# EAGLE design Main (EAGLE 7.2.0)
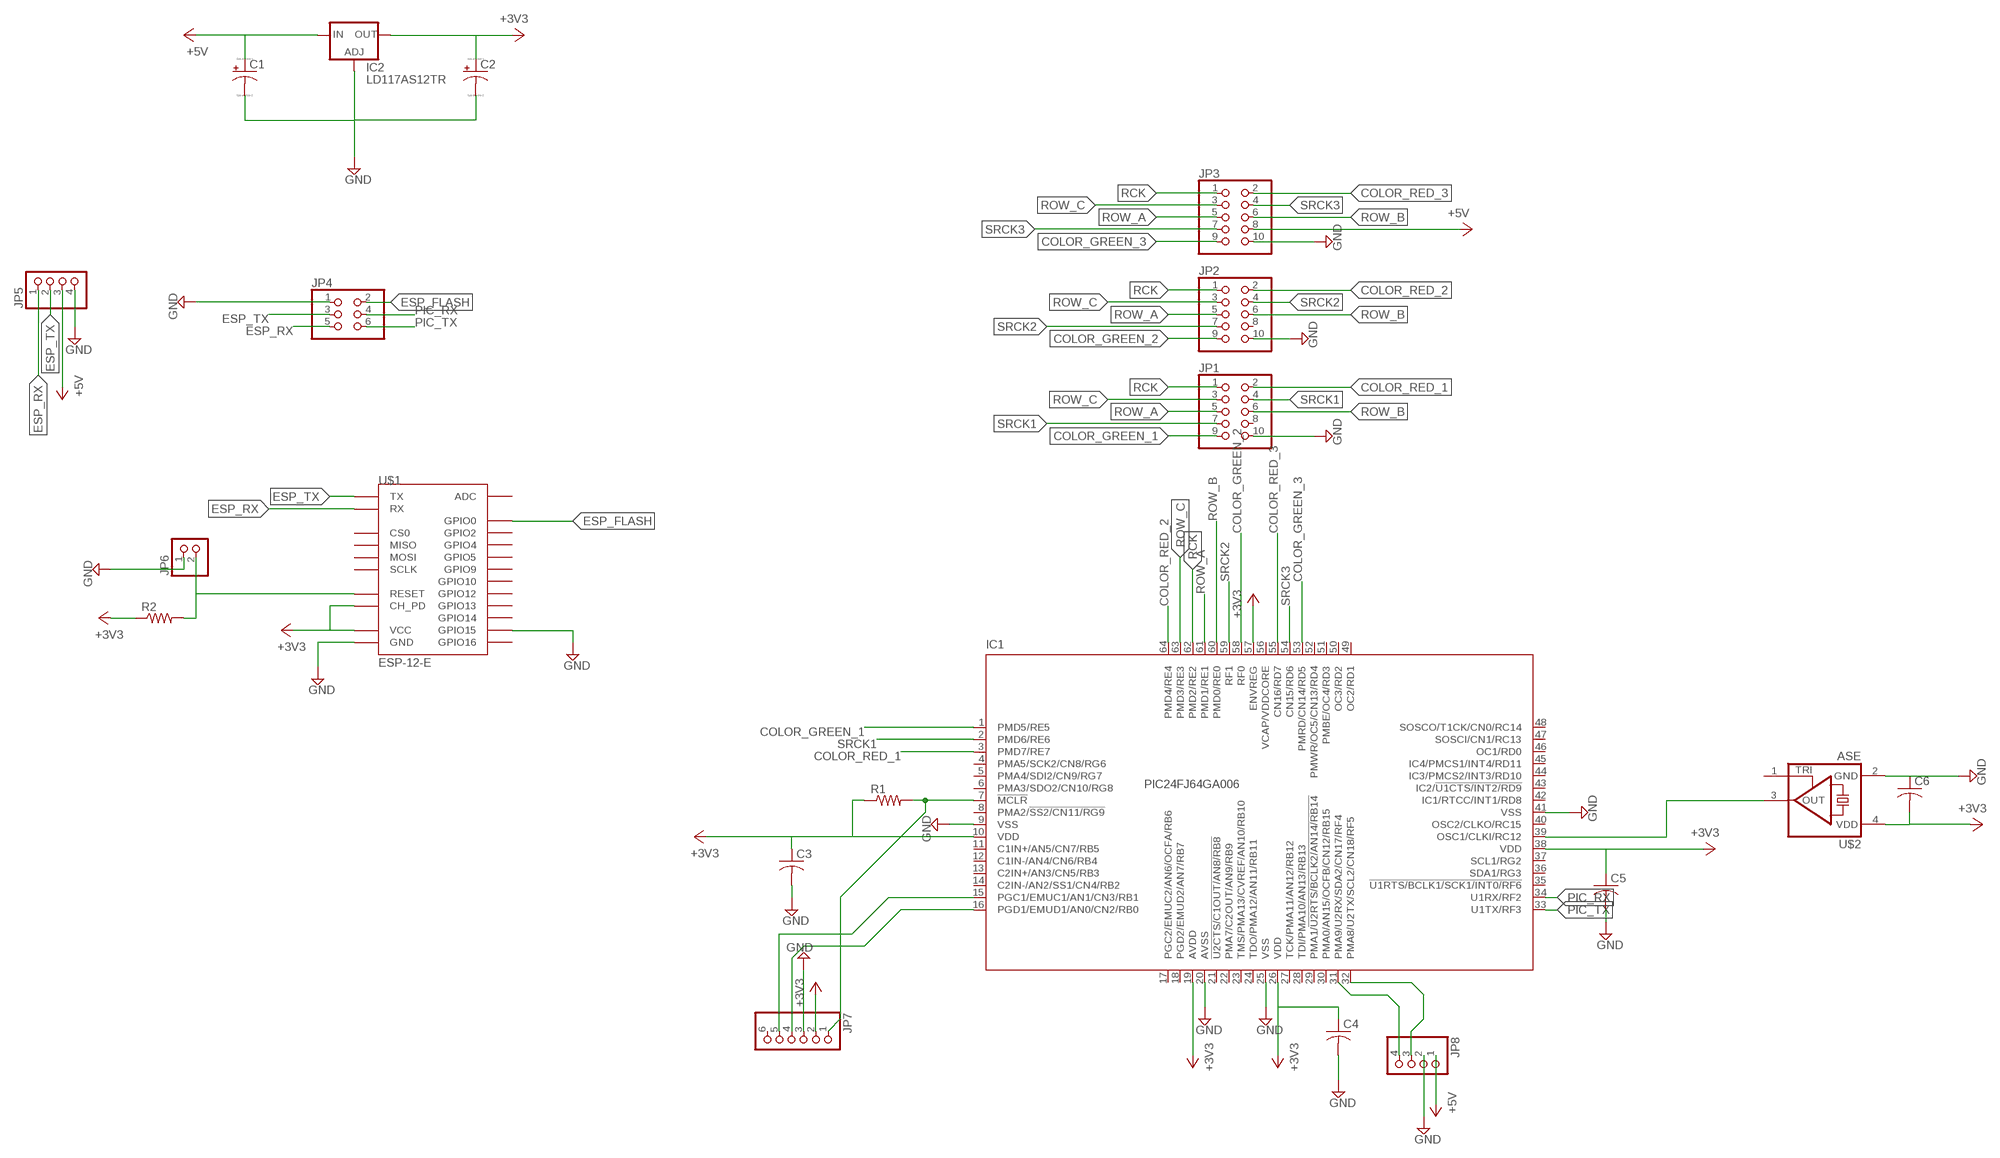
[diagram p0: schematic, sheet 1]

## Parts
C1  CPOL-USB/3528-21W  [B/3528-21W]
C2  CPOL-USB/3528-21W  [B/3528-21W]
C3  C-USC0603K  [C0603K]
C4  C-USC0603K  [C0603K]
C5  C-USC0603K  [C0603K]
C6  C-USC0603K  [C0603K]
IC1  PIC24FJ64GA006  [TQFP64-10X10]
IC2  LD117AS12TR  [SOT223]
JP1  PINHD-2X5  [2X05]
JP2  PINHD-2X5  [2X05]
JP3  PINHD-2X5  [2X05]
JP4  PINHD-2X3  [2X03]
JP5  PINHD-1X4  [1X04]
JP6  PINHD-1X2  [1X02]
JP7  PINHD-1X6  [1X06]
JP8  PINHD-1X4  [1X04]
R1  R-US_MELF0102W  [MINI_MELF-0102W]
R2  R-US_MELF0102W  [MINI_MELF-0102W]
U$1  ESP-12-E  [ESP-12-E]
U$2  ASE  [ASE]

## Nets
+3V3: C2.+ C3.1 C4.1 C5.1 C6.2 IC1.10(VDD) IC1.19(AVDD) IC1.26(VDD) IC1.38(VDD) IC1.57(ENVREG) IC2.4(OUT) JP7.2 R1.1 R2.1 U$1.CH_PD U$1.VCC U$2.4(VDD)
+5V: C1.+ IC2.3(IN) JP3.8 JP5.3 JP8.1
COLOR_GREEN_1: IC1.1(PMD5/RE5) JP1.9
COLOR_GREEN_2: IC1.58(RF0) JP2.9
COLOR_GREEN_3: IC1.53(PMRD/CN14/RD5) JP3.9
COLOR_RED_1: IC1.3(PMD7/RE7) JP1.2
COLOR_RED_2: IC1.64(PMD4/RE4) JP2.2
COLOR_RED_3: IC1.55(CN16/RD7) JP3.2
ESP_FLASH: JP4.2 U$1.GPIO0
ESP_RX: JP4.5 JP5.1 U$1.RX
ESP_TX: JP4.3 JP5.2 U$1.TX
GND: C1.- C2.- C3.2 C4.2 C5.2 C6.1 IC1.9(VSS) IC1.20(AVSS) IC1.25(VSS) IC1.41(VSS) IC2.1(ADJ) JP1.10 JP2.10 JP3.10 JP4.1 JP5.4 JP6.1 JP7.3 JP8.2 U$1.GND U$1.GPIO15 U$2.2(GND)
N$1: IC1.39(OSC1/CLKI/RC12) U$2.3(OUT)
N$2: JP6.2 R2.2 U$1.RESET
N$3: IC1.15(PGC1/EMUC1/AN1/CN3/RB1) JP7.5
N$4: IC1.32(PMA8/U2TX/SCL2/CN18/RF5) JP8.3
N$5: IC1.16(PGD1/EMUD1/AN0/CN2/RB0) JP7.4
N$6: IC1.31(PMA9/U2RX/SDA2/CN17/RF4) JP8.4
N$7: IC1.7(!MCLR) JP7.1 R1.2
PIC_RX: IC1.34(U1RX/RF2) JP4.4
PIC_TX: IC1.33(U1TX/RF3) JP4.6
RCK: IC1.62(PMD2/RE2) JP1.1 JP2.1 JP3.1
ROW_A: IC1.61(PMD1/RE1) JP1.5 JP2.5 JP3.5
ROW_B: IC1.60(PMD0/RE0) JP1.6 JP2.6 JP3.6
ROW_C: IC1.63(PMD3/RE3) JP1.3 JP2.3 JP3.3
SRCK1: IC1.2(PMD6/RE6) JP1.4 JP1.7
SRCK2: IC1.59(RF1) JP2.4 JP2.7
SRCK3: IC1.54(CN15/RD6) JP3.4 JP3.7
Unconnected: IC1.4(PMA5/SCK2/CN8/RG6) IC1.5(PMA4/SDI2/CN9/RG7) IC1.6(PMA3/SDO2/CN10/RG8) IC1.8(PMA2/!SS2/CN11/RG9) IC1.11(C1IN+/AN5/CN7/RB5) IC1.12(C1IN-/AN4/CN6/RB4) IC1.13(C2IN+/AN3/CN5/RB3) IC1.14(C2IN-/AN2/SS1/CN4/RB2) IC1.17(PGC2/EMUC2/AN6/OCFA/RB6) IC1.18(PGD2/EMUD2/AN7/RB7) IC1.21(!U2CTS/C1OUT/AN8/RB8) IC1.22(PMA7/C2OUT/AN9/RB9) IC1.23(TMS/PMA13/CVREF/AN10/RB10) IC1.24(TDO/PMA12/AN11/RB11) IC1.27(TCK/PMA11/AN12/RB12) IC1.28(TDI/PMA10/AN13/RB13) IC1.29(PMA1/!U2RTS/BCLK2/AN14/RB14) IC1.30(PMA0/AN15/OCFB/CN12/RB15) IC1.35(!U1RTS/BCLK1/SCK1/INT0/RF6) IC1.36(SDA1/RG3) IC1.37(SCL1/RG2) IC1.40(OSC2/CLKO/RC15) IC1.42(IC1/RTCC/INT1/RD8) IC1.43(IC2/!U1CTS/INT2/RD9) IC1.44(IC3/PMCS2/INT3/RD10) IC1.45(IC4/PMCS1/INT4/RD11) IC1.46(OC1/RD0) IC1.47(SOSCI/CN1/RC13) IC1.48(SOSCO/T1CK/CN0/RC14) IC1.49(OC2/RD1) IC1.50(OC3/RD2) IC1.51(PMBE/OC4/RD3) IC1.52(PMWR/OC5/CN13/RD4) IC1.56(VCAP/VDDCORE) JP1.8 JP2.8 JP7.6 U$1.ADC U$1.CS0 U$1.GPIO2 U$1.GPIO4 U$1.GPIO5 U$1.GPIO9 U$1.GPIO10 U$1.GPIO12 U$1.GPIO13 U$1.GPIO14 U$1.GPIO16 U$1.MISO U$1.MOSI U$1.SCLK U$2.1(TRI)

## Library data of the parts
C1 C2 = resistor:CPOL-US: POLARIZED CAPACITOR, American symbol
C3-C6 = resistor:C-US: CAPACITOR, American symbol
IC1 = microchip:PIC24FJ*GA006: 64/80/100-Pin General Purpose, 16-Bit Flash Microcontrollers Source: http://ww1.microchip.com/downloads/en/DeviceDoc/39747d.pdf; MPN: PIC24FJ64GA006-I/PT; OC_FARNELL: 1146524; OC_NEWARK: 56K7343
IC2 = v-reg:LD117A?*: Low drop fixed and adjustable positive voltage regulators 1 A Source: http://www.st.com/stonline/products/literature/ds/7194/ld1117axx.pdf
JP1-JP3 = pinhead:PINHD-2X5: PIN HEADER
JP4 = pinhead:PINHD-2X3: PIN HEADER
JP5 JP8 = pinhead:PINHD-1X4: PIN HEADER
JP6 = pinhead:PINHD-1X2: PIN HEADER
JP7 = pinhead:PINHD-1X6: PIN HEADER
R1 R2 = resistor:R-US_: RESISTOR, American symbol
U$1 = esp8266modules:ESP-12-E: ESP8266 Wifi Module ESP-12-E; DIMENSIONS: 24.0 x 16.0 mm; PINS: 22; PITCH: 0.078" / 2 mm
U$2 = crystal:ASE: 3.3Vdc CMOS SMD CRYSTAL CLOCK OSCILLATOR SOurce: www.abracon.com; OC_FARNELL: unknown; OC_NEWARK: unknown

## Board
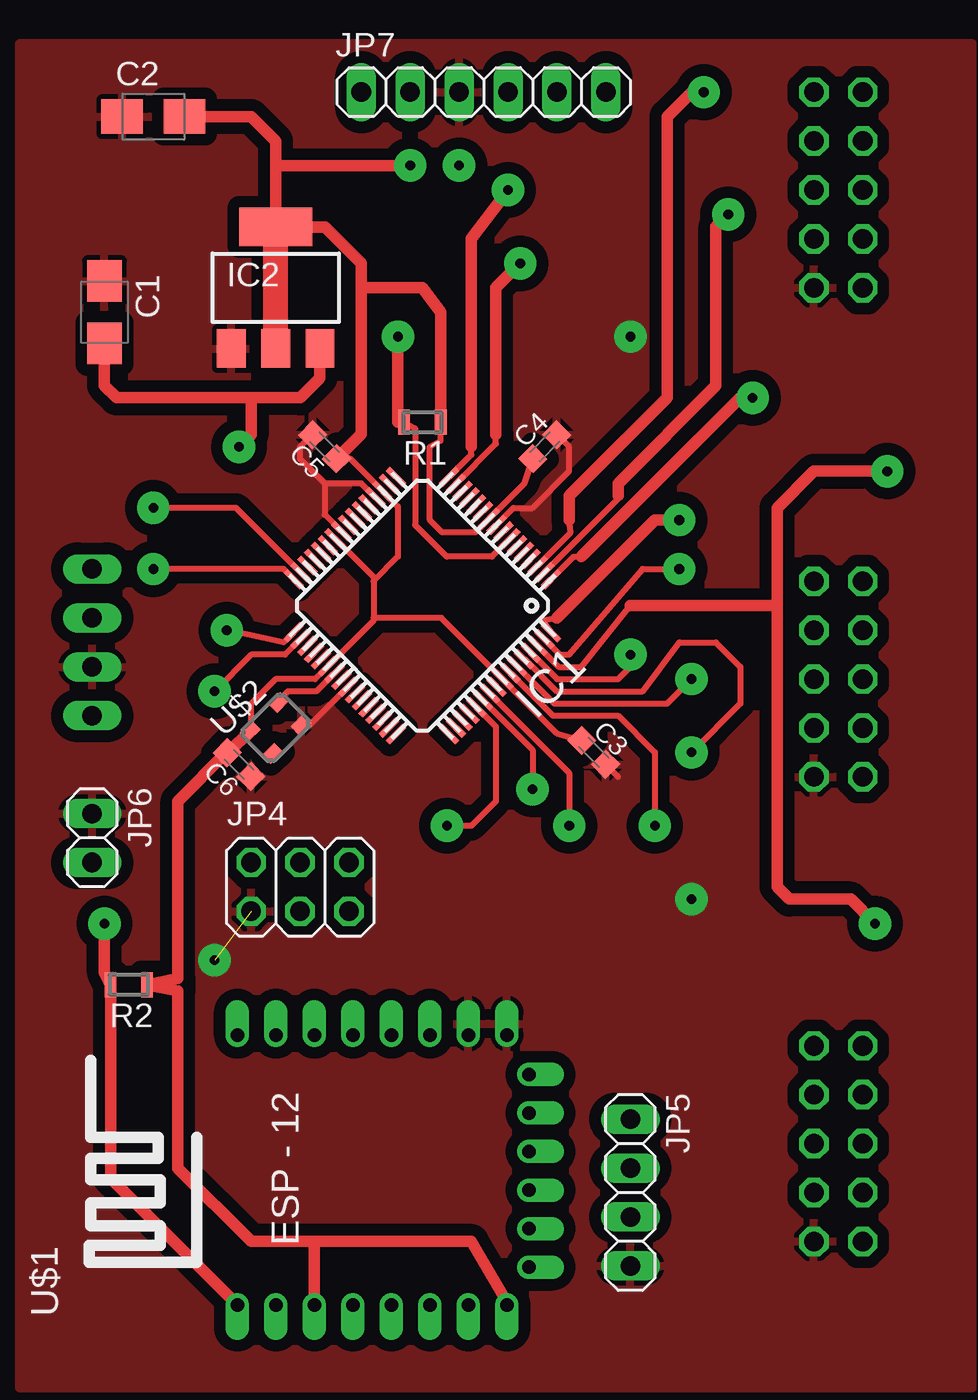
[diagram p1: board, top side]
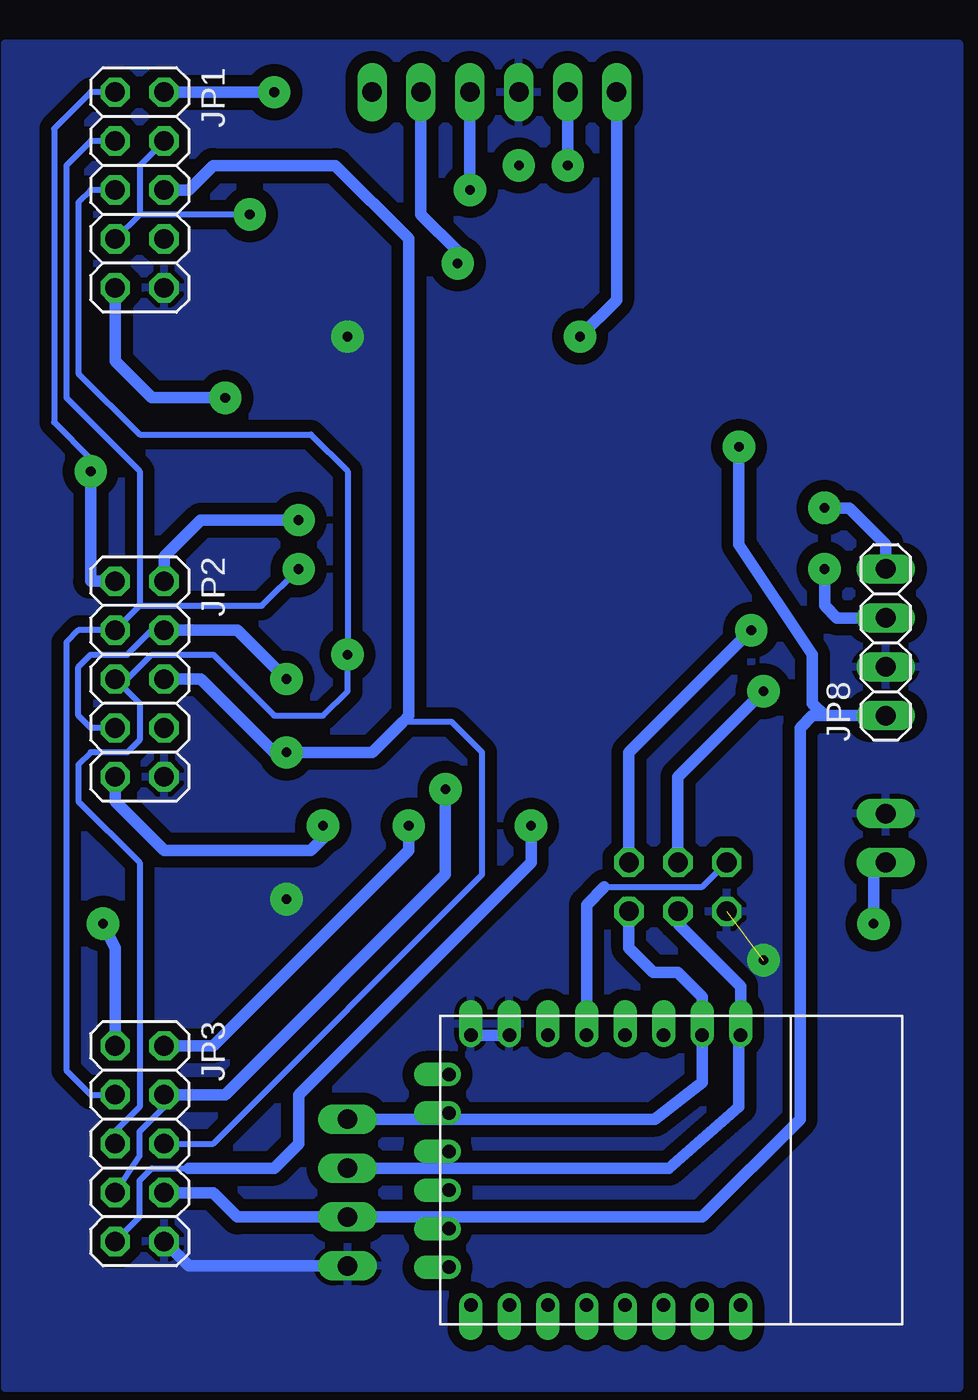
[diagram p2: board, bottom side, seen from below]

No outline drawn. Coordinates in mm, seen from the top.
Copper layers (1*16): Top 0.035mm / dielectric 1.5mm / Bottom 0.035mm
Design rules "default": minimum track width 10mil, minimum drill 24mil, track to track 8mil, track to pad 8mil, pad to pad 8mil, via to via 8mil, smd to smd 8mil, copper to edge 40mil, drill to drill 8mil, minimum pad ring 10mil, minimum via ring 8mil, stop-mask expansion 4mil, vias tented up to drill 0mil, thermal gap 10mil

### Footprints (pad centres in the part's own frame; a part is rotated, then mirrored left to right if it is on the bottom)
B/3528-21W = smd 2.15 x 1.8: + 1.625,0; - -1.625,0
C0603K = smd 1.05 x 1.08: 1 -0.875,0; 2 0.875,0
TQFP64-10X10 = smd 1.2 x 0.3: 1 -5.7,3.75; 2 -5.7,3.25; 3 -5.7,2.75; 4 -5.7,2.25; 5 -5.7,1.75; 6 -5.7,1.25; 7 -5.7,0.75; 8 -5.7,0.25; 9 -5.7,-0.25; 10 -5.7,-0.75; 11 -5.7,-1.25; 12 -5.7,-1.75; 13 -5.7,-2.25; 14 -5.7,-2.75; 15 -5.7,-3.25; 16 -5.7,-3.75; 33 5.7,-3.75; 34 5.7,-3.25; 35 5.7,-2.75; 36 5.7,-2.25; 37 5.7,-1.75; 38 5.7,-1.25; 39 5.7,-0.75; 40 5.7,-0.25; 41 5.7,0.25; 42 5.7,0.75; 43 5.7,1.25; 44 5.7,1.75; 45 5.7,2.25; 46 5.7,2.75; 47 5.7,3.25; 48 5.7,3.75 | smd 0.3 x 1.2: 17 -3.75,-5.7; 18 -3.25,-5.7; 19 -2.75,-5.7; 20 -2.25,-5.7; 21 -1.75,-5.7; 22 -1.25,-5.7; 23 -0.75,-5.7; 24 -0.25,-5.7; 25 0.25,-5.7; 26 0.75,-5.7; 27 1.25,-5.7; 28 1.75,-5.7; 29 2.25,-5.7; 30 2.75,-5.7; 31 3.25,-5.7; 32 3.75,-5.7; 49 3.75,5.7; 50 3.25,5.7; 51 2.75,5.7; 52 2.25,5.7; 53 1.75,5.7; 54 1.25,5.7; 55 0.75,5.7; 56 0.25,5.7; 57 -0.25,5.7; 58 -0.75,5.7; 59 -1.25,5.7; 60 -1.75,5.7; 61 -2.25,5.7; 62 -2.75,5.7; 63 -3.25,5.7; 64 -3.75,5.7
SOT223 = smd 1.5 x 2: 1 -2.3,-3.15; 2 0,-3.15; 3 2.3,-3.15 | smd 3.8 x 2: 4 0,3.15
2X05 = drill 1.016 octagon: 1 -5.08,-1.27; 2 -5.08,1.27; 3 -2.54,-1.27; 4 -2.54,1.27; 5 0,-1.27; 6 0,1.27; 7 2.54,-1.27; 8 2.54,1.27; 9 5.08,-1.27; 10 5.08,1.27
2X03 = drill 1.016 octagon: 1 -2.54,-1.27; 2 -2.54,1.27; 3 0,-1.27; 4 0,1.27; 5 2.54,-1.27; 6 2.54,1.27
1X04 = drill 1.016 long: 1 -3.81,0; 2 -1.27,0; 3 1.27,0; 4 3.81,0
1X02 = drill 1.016 long: 1 -1.27,0; 2 1.27,0
1X06 = drill 1.016 long: 1 -6.35,0; 2 -3.81,0; 3 -1.27,0; 4 1.27,0; 5 3.81,0; 6 6.35,0
MINI_MELF-0102W = smd 0.6 x 1.3: 1 -0.95,0; 2 0.95,0
ESP-12-E = drill 0.7 offset: ADC -7.1,3.8; CH_PD -7.1,1.8; CS0 -5.14,-9.33; GND 6.9,-8.2; GPIO0 6.9,-2.2; GPIO2 6.9,-4.2; GPIO4 6.9,1.8; GPIO5 6.9,-0.2; GPIO9 -1.14,-9.33; GPIO10 0.86,-9.33; GPIO12 -7.1,-4.2; GPIO13 -7.1,-6.2; GPIO14 -7.1,-2.2; GPIO15 6.9,-6.2; GPIO16 -7.1,-0.2; MISO -3.14,-9.33; MOSI 2.86,-9.33; RESET -7.1,5.8; RX 6.9,3.8; SCLK 4.86,-9.33; TX 6.9,5.8; VCC -7.1,-8.2
ASE = smd 0.9 x 0.65: 1 -1.05,-0.825; 2 1.05,-0.825; 3 1.05,0.825; 4 -1.05,0.825

### Placement (x,y rotation side)
C1  52.07,69.85 270 top
C2  54.61,80.01 0 top
C3  77.47,46.99 315 top
C4  74.93,62.87 45 top
C5  63.5,62.87 135 top
C6  59.05,46.35 135 top
IC1  68.58,54.61 225 top
IC2  60.96,71.12 0 top
JP1  90.17,76.2 270 bottom
JP2  90.17,50.8 270 bottom
JP3  90.17,26.67 270 bottom
JP4  62.23,40.01 0 top
JP5  79.38,24.13 270 top
JP6  51.44,42.55 270 top
JP7  71.75,81.28 0 top
JP8  51.44,52.7 90 bottom
R1  68.58,64.14 180 top
R2  53.34,34.92 180 top
U$1  64.77,25.4 90 top
U$2  60.96,48.26 45 top

### Tracks (layer width: path | path; a pad name or v marks a point on that pad's centre or on a via)
+3V3  (via drill 0.5 pad 1.68)
  Top 0.305: U$2.4 59.69,48.16 59.69,49.53 60.96,50.8 63,50.8 IC1.38 66.04,53.84 66.04,53.98 | 74.3,62.23 C4.1 73.89,60.98 IC1.10 71.33,58.42 69.6,58.42 68.96,59.05 68.96,62.87 69.53,63.18 R1.1 | IC1.26 66.04,56.09 66.04,55.88 | 66.04,55.88 66.04,53.98 | 66.04,55.88 67.31,57.15 67.31,59.77 IC1.19 64.83,62.25 C5.1 | 66.04,53.98 69.57,53.98 IC1.57 75.56,47.98 C3.1
  Top 0.61: U$1.CH_PD 62.97,21.59 | 62.97,21.59 59.69,21.59 55.88,25.4 55.88,34.6 R2.1 55.88,35.24 55.88,44.45 58.4,46.97 C6.2 58.51,46.97 U$2.4 | U$1.VCC 72.97,18.47 71.12,21.59 62.97,21.59 | 60.96,77.47 60.96,78.74 59.69,80.01 C2.+ | 60.96,77.47 IC2.4 63.52,74.27 65.41,72.39 65.41,71.12 | 60.96,77.47 v67.94,77.47 | C5.1 65.41,63.53 65.41,71.12 | R1.1 69.53,69.85 68.58,71.12 65.41,71.12
  Bottom 0.61: JP7.2 v67.94,77.47
+5V  (via drill 0.5 pad 1.68)
  Top 0.61: IC2.3 63.26,66.44 62.23,65.41 59.69,65.41 | 59.69,65.41 59.69,63.5 v59.05,62.87 | C1.+ 52.07,66.04 52.7,65.41 59.69,65.41
  Bottom 0.61: JP3.8 86.36,24.13 85.09,22.86 JP5.3 60.96,22.86 55.88,27.94 55.88,48.26 55.24,48.9 54.61,48.9 | 54.61,48.9 55.24,49.53 55.24,52.07 59.05,57.78 v59.05,62.87 | 54.61,48.9 JP8.1
COLOR_GREEN_1  (via drill 0.5 pad 1.68)
  Top 0.305: IC1.1 76.42,57.15 76.83,57.15
  Top 0.61: 76.83,57.15 85.09,65.41 v85.72,65.41
  Bottom 0.61: JP1.9 91.44,67.31 89.53,65.41 v85.72,65.41
COLOR_GREEN_2  (via drill 0.5 pad 1.68)
  Top 0.305: IC1.58 75.36,48.9 78.74,48.9 80.64,46.99 v80.64,43.18
  Bottom 0.61: v80.64,43.18 80.64,42.55 81.28,41.91 88.9,41.91 91.44,44.45 JP2.9
COLOR_GREEN_3  (via drill 0.5 pad 1.68)
  Top 0.305: IC1.53 72.39,48.33 72.39,44.45 71.12,43.18 v69.85,43.18
  Bottom 0.305: JP3.9 90.17,22.86 90.17,24.77 89.53,25.4 87.63,25.4
  Bottom 0.61: 87.63,25.4 83.19,25.4 81.92,26.67 81.92,29.21 69.85,41.27 v69.85,43.18
COLOR_RED_1  (via drill 0.5 pad 1.68)
  Top 0.305: IC1.3 76.28,58.42 76.2,59.05
  Top 0.61: 76.2,59.05 76.2,60.33 81.28,65.41 81.28,80.01 82.55,81.28 v83.19,81.28
  Bottom 0.61: JP1.2 v83.19,81.28
COLOR_RED_2  (via drill 0.5 pad 1.68)
  Top 0.305: IC1.64 74.82,53.87 75.56,53.98
  Top 0.61: 75.56,53.98 80.64,59.05 v81.92,59.05
  Bottom 0.61: JP2.2 88.9,57.15 87,59.05 v81.92,59.05
COLOR_RED_3  (via drill 0.5 pad 1.68)
  Top 0.305: IC1.55 76.2,45.93 v76.2,43.18
  Bottom 0.61: v76.2,43.18 76.2,41.91 86.36,31.75 JP3.2
ESP_FLASH
  Bottom 0.305: 66.04,40.01 60.96,40.01 JP4.2
  Bottom 0.61: U$1.GPIO0 66.97,39.08 66.04,40.01
ESP_RX
  Bottom 0.61: JP4.5 64.77,36.83 63.5,35.56 62.23,35.56 60.97,34.3 U$1.RX 60.96,31.11 60.96,29.84 63.42,27.94 JP5.1
ESP_TX
  Bottom 0.61: JP4.3 62.23,38.1 58.97,34.84 U$1.TX 59.05,31.75 59.05,28.57 62.7,25.4 JP5.2
GND  (via drill 0.5 pad 1.68)  (1 unrouted)
  Top 0.305: 63.5,60.96 62.23,62.23 62.23,62.87 62.85,63.48 C5.2 | IC1.41 62.74,48.42 U$2.2 | IC1.9 73.31,59.69 74.3,59.69 76.2,61.59 76.2,62.87 75.58,63.48 C4.2 | IC1.20 65.41,60.96 63.5,60.96 | 63.5,60.96 63.5,59.34 IC1.25 | C3.2 78.74,45.72 | 78.74,45.72
  Bottom 0.61: JP5.4 87.63,20.32 JP3.10 | U$1.GND U$1.GPIO15
  other vias: 79.38,68.58 82.55,39.37 57.78,36.2
  pour Top (isolate 0.61): 47.62,83.82 47.62,13.97 97.16,13.97 97.16,83.82
  pour Bottom (isolate 0.61): 47.62,83.82 47.62,13.97 97.16,13.97 97.16,83.82
N$1
  Top 0.305: IC1.39 63.07,50.16 61.59,50.16 61.12,49.69 U$2.3
N$2  (via drill 0.5 pad 1.68)
  Top 0.61: U$1.RESET 52.39,24.88 R2.2 52.07,35.56 v52.07,38.1
  Bottom 0.61: JP6.2 52.07,40.64 v52.07,38.1
N$3  (via drill 0.5 pad 1.68)
  Top 0.305: IC1.15 72.39,63.02 72.39,63.5
  Top 0.61: 72.39,63.5 72.39,71.12 v73.66,72.39
  Bottom 0.61: JP7.5 75.56,74.93 73.66,73.03 v73.66,72.39
N$4  (via drill 0.5 pad 1.68)
  Top 0.305: IC1.32 61.37,56.52 v54.61,56.52
  Bottom 0.61: JP8.3 53.98,53.98 54.61,54.61 v54.61,56.52
N$5  (via drill 0.5 pad 1.68)
  Top 0.305: IC1.16 71.12,62.45 71.12,62.87
  Top 0.61: v73.03,76.2 71.12,73.66 71.12,62.87
  Bottom 0.61: JP7.4 v73.03,76.2
N$6  (via drill 0.5 pad 1.68)
  Top 0.305: IC1.31 58.9,59.69 v54.61,59.69
  Bottom 0.61: JP8.4 51.44,57.78 53.34,59.69 v54.61,59.69
N$7  (via drill 0.5 pad 1.68)
  Top 0.305: R1.2 68.2,63.82 68.2,58.8 69.85,57.15 72.18,57.15 IC1.7
  Top 0.61: v67.31,68.58 67.31,64.14 R1.2
  Bottom 0.61: JP7.1 65.41,70.48 v67.31,68.58
N$9  (via drill 0.5 pad 1.68)
  other vias: 70.48,77.47
PIC_RX  (via drill 0.5 pad 1.68)
  Top 0.305: IC1.34 61.44,52.07 59.69,52.07 v57.78,50.16
  Bottom 0.61: v57.78,50.16 62.23,45.72 JP4.4
PIC_TX  (via drill 0.5 pad 1.68)
  Top 0.305: IC1.33 61.37,52.7 v58.42,53.34
  Bottom 0.61: v58.42,53.34 64.77,46.99 JP4.6
RCK  (via drill 0.5 pad 1.68)
  Top 0.305: IC1.62 75.64,51.44 76.83,51.44 79.38,54.61
  Top 0.61: 79.38,54.61 87,54.61 | 87,54.61 87,59.69 88.9,61.59 v92.71,61.59 | v92.08,38.1 90.81,39.37 87.63,39.37 87,40.01 87,54.61
  Bottom 0.305: JP1.1 92.71,81.28 94.61,79.38 94.61,64.14 92.71,62.23 v92.71,61.59
  Bottom 0.61: JP2.1 92.71,55.88 v92.71,61.59 | JP3.1 91.44,36.83 v92.08,38.1
ROW_A  (via drill 0.5 pad 1.68)
  Top 0.305: IC1.61 75.57,50.8 78.74,50.8 79.38,51.44 v79.38,52.07
  Bottom 0.305: JP3.5 91.44,27.3 90.17,28.57 90.17,41.27 93.34,44.45 93.34,46.35 92.71,46.99 90.81,46.99 90.17,47.62 90.17,49.53 JP2.5 90.81,50.8 89.53,52.07 86.36,52.07 83.19,48.9 80.64,48.9 79.38,50.16 v79.38,52.07 79.38,61.59 81.28,63.5 90.17,63.5 93.34,66.67 93.34,75.56 92.71,76.2 JP1.5
ROW_B  (via drill 0.5 pad 1.68)
  Top 0.305: IC1.60 73.91,51.82 75.56,50.16 80.01,50.16 81.92,52.7 83.82,52.7 85.09,51.44 85.09,49.53 v82.55,46.99
  Bottom 0.305: JP3.6 86.36,26.67 72.39,40.64 72.39,46.99 73.98,48.58 76.52,48.58
  Bottom 0.61: JP2.6 87,50.8 83.19,46.99 v82.55,46.99 78.11,46.99 76.52,48.58 76.2,48.9 76.2,73.66 80.01,77.47 86.36,77.47 87.63,76.2 JP1.6
ROW_C  (via drill 0.5 pad 1.68)
  Top 0.305: v81.92,56.52 80.01,56.52 79.7,56.14 76.2,52.07 75.72,52.07 IC1.63
  Bottom 0.305: 90.17,54.61 JP2.3 93.34,53.34 93.98,52.7 93.98,30.48 92.71,29.21 JP3.3 | 90.17,54.61 83.82,54.61 v81.92,56.52 | JP1.3 92.71,78.74 93.98,77.47 93.98,65.41 90.17,61.59 90.17,54.61
SRCK1  (via drill 0.5 pad 1.68)
  Top 0.305: IC1.2 78.89,60.33 78.74,60.33
  Top 0.61: 78.74,60.33 78.74,60.96 83.82,66.04 83.82,74.3 v84.45,74.93
  Bottom 0.305: JP1.4 90.17,77.47 90.17,74.93 | 90.17,74.93 JP1.7 | v84.45,74.93 90.17,74.93
SRCK2  (via drill 0.5 pad 1.68)
  Top 0.305: IC1.59 75.43,49.53 81.28,49.53 v82.55,50.8
  Bottom 0.305: JP2.7 92.71,48.26 93.34,48.9 93.34,51.44 92.71,52.07 90.81,52.07 89.53,53.34 JP2.4
  Bottom 0.61: v82.55,50.8 85.09,53.34 JP2.4
SRCK3  (via drill 0.5 pad 1.68)
  Top 0.305: IC1.54 74.3,47.13 v74.3,45.09
  Bottom 0.305: JP3.7 90.17,26.04 90.17,27.3 88.9,28.57 JP3.4
  Bottom 0.61: v74.3,45.09 74.3,40.64 85.72,29.21 JP3.4
(copper drawn outside any net)
  shapes: Top area x1